# EAGLE design B105B (EAGLE 6.6.0)
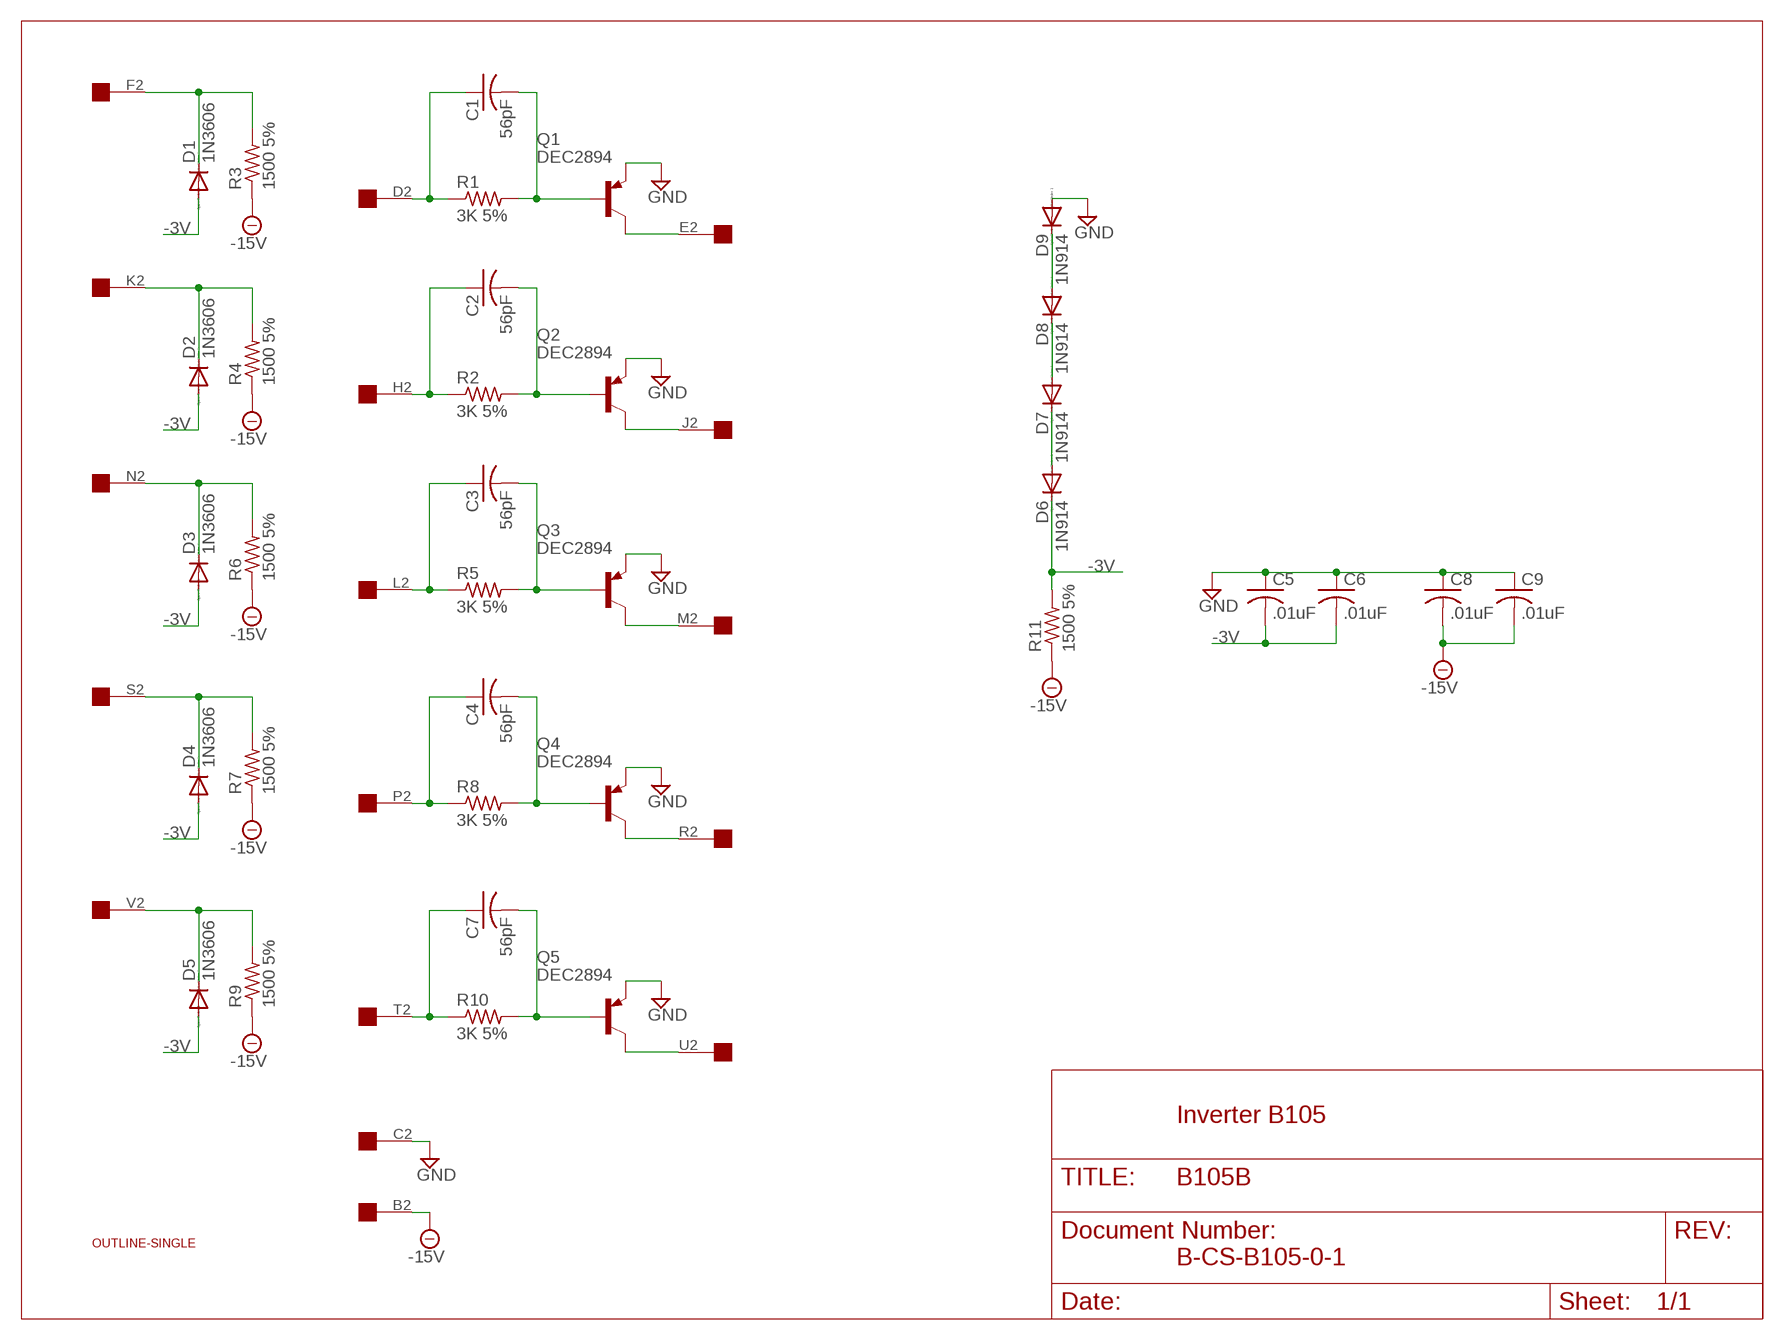
[diagram p0: schematic, sheet 1]

## Parts
C1  56pF  C-US075-032X103  [C075-032X103]
C2  56pF  C-US075-032X103  [C075-032X103]
C3  56pF  C-US075-032X103  [C075-032X103]
C4  56pF  C-US075-032X103  [C075-032X103]
C5  .01uF  C-US050-025X075  [C050-025X075]
C6  .01uF  C-US050-025X075  [C050-025X075]
C7  56pF  C-US075-032X103  [C075-032X103]
C8  .01uF  C-US050-025X075  [C050-025X075]
C9  .01uF  C-US050-025X075  [C050-025X075]
D1  1N3606  1N4148DO35-10  [DO35-10]
D2  1N3606  1N4148DO35-10  [DO35-10]
D3  1N3606  1N4148DO35-10  [DO35-10]
D4  1N3606  1N4148DO35-10  [DO35-10]
D5  1N3606  1N4148DO35-10  [DO35-10]
D6  1N914  1N4148DO35-10  [DO35-10]
D7  1N914  1N4148DO35-10  [DO35-10]
D8  1N914  1N4148DO35-10  [DO35-10]
D9  1N914  1N4148DO35-10  [DO35-10]
Q1  DEC2894  2N2904  [TO39]
Q2  DEC2894  2N2904  [TO39]
Q3  DEC2894  2N2904  [TO39]
Q4  DEC2894  2N2904  [TO39]
Q5  DEC2894  2N2904  [TO39]
R1  3K 5%  R-US_0207/10  [0207/10]
R2  3K 5%  R-US_0207/10  [0207/10]
R3  1500 5%  R-US_0207/10  [0207/10]
R4  1500 5%  R-US_0207/10  [0207/10]
R5  3K 5%  R-US_0207/10  [0207/10]
R6  1500 5%  R-US_0207/10  [0207/10]
R7  1500 5%  R-US_0207/10  [0207/10]
R8  3K 5%  R-US_0207/10  [0207/10]
R9  1500 5%  R-US_0207/10  [0207/10]
R10  3K 5%  R-US_0207/10  [0207/10]
R11  1500 5%  R-US_0207/10  [0207/10]
U$1  OUTLINE-SINGLE  [SINGLE]
U$2  EDGE-1  [EDGE-CON1]

## Nets
-3V [Supply]: C5.2 C6.2 D1.A D2.A D3.A D4.A D5.A D6.C R11.2
-15V: C8.2 C9.2 R3.1 R4.1 R6.1 R7.1 R9.1 R11.1 U$2.B2
GND [Supply]: C5.1 C6.1 C8.1 C9.1 D9.A Q1.1(E) Q2.1(E) Q3.1(E) Q4.1(E) Q5.1(E) U$2.C2
N$1: C1.1 R1.1 U$2.D2
N$3: C1.2 Q1.2(B) R1.2
N$4: Q1.3(C) U$2.E2
N$5: D1.C R3.2 U$2.F2
N$6: C2.1 R2.1 U$2.H2
N$8: C2.2 Q2.2(B) R2.2
N$9: Q2.3(C) U$2.J2
N$10: D2.C R4.2 U$2.K2
N$11: C3.1 R5.1 U$2.L2
N$13: C3.2 Q3.2(B) R5.2
N$14: Q3.3(C) U$2.M2
N$15: D3.C R6.2 U$2.N2
N$16: C4.1 R8.1 U$2.P2
N$18: C4.2 Q4.2(B) R8.2
N$19: Q4.3(C) U$2.R2
N$20: D4.C R7.2 U$2.S2
N$21: C7.1 R10.1 U$2.T2
N$23: C7.2 Q5.2(B) R10.2
N$24: Q5.3(C) U$2.U2
N$25: D5.C R9.2 U$2.V2
N$26: D8.A D9.C
N$27: D7.A D8.C
N$29: D6.A D7.C
Unconnected: U$2.A2

## Notes on the sheet
- Inverter B105
- B-CS-B105-0-1

## Library data of the parts
C1-C9 = rcl:C-US: CAPACITOR, American symbol
D1-D9 = diode:1N4148: DIODE high speed (Philips)
Q1-Q5 = transistor-pnp:2N2904*: PNP Transistror
R1-R11 = rcl:R-US_: RESISTOR, American symbol
U$1 = dec-con:OUTLINE-*: Board outlines for DEC boards.
U$2 = dec-con:EDGE-1: Single-Sided DEC Edge Connector -- (side 2)

## Net classes
1 Supply: width 0.813 mm

## Board
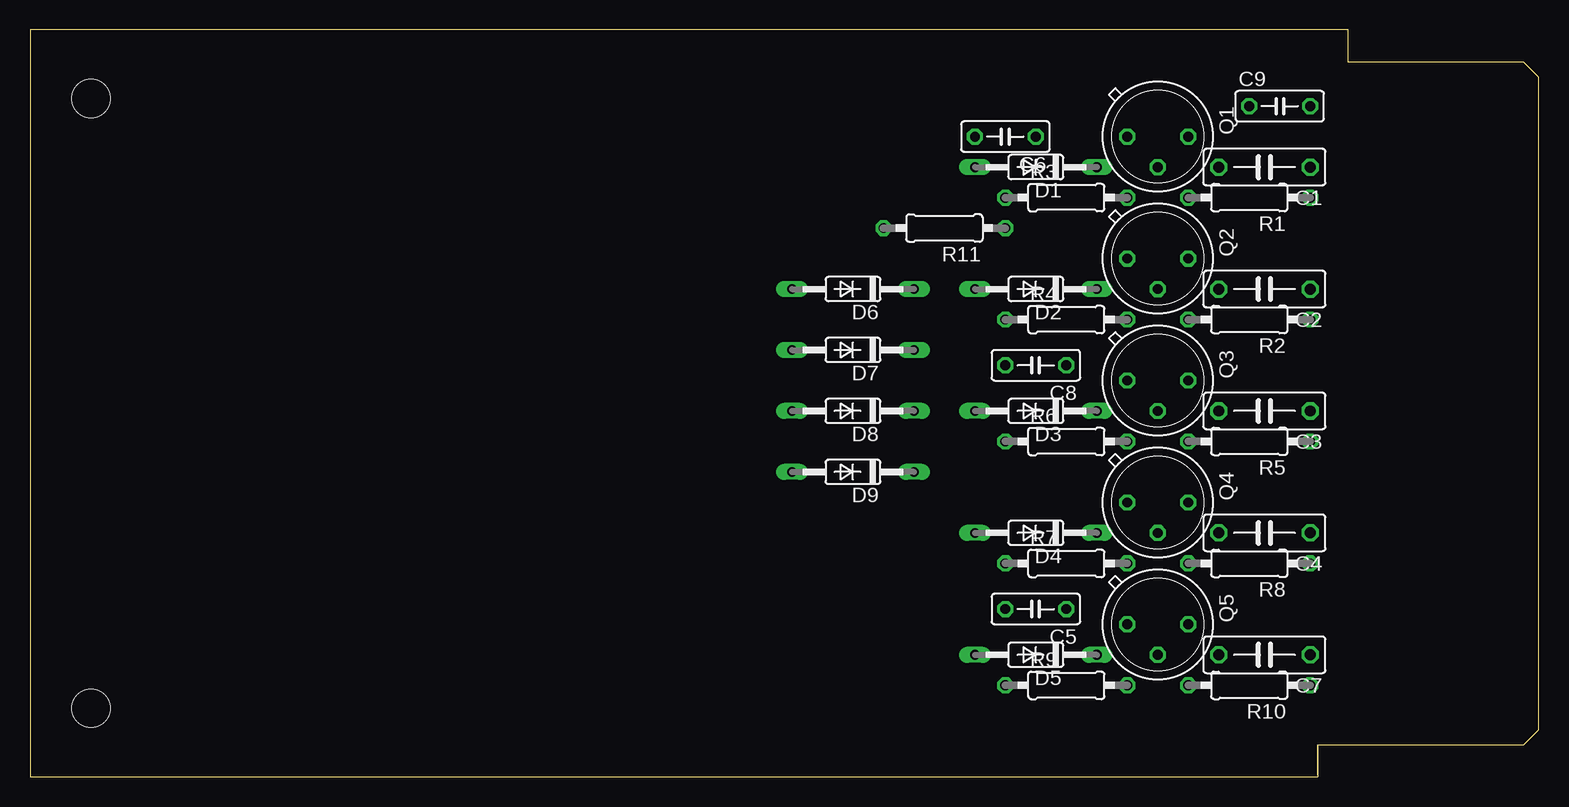
[diagram p1: board, top side]
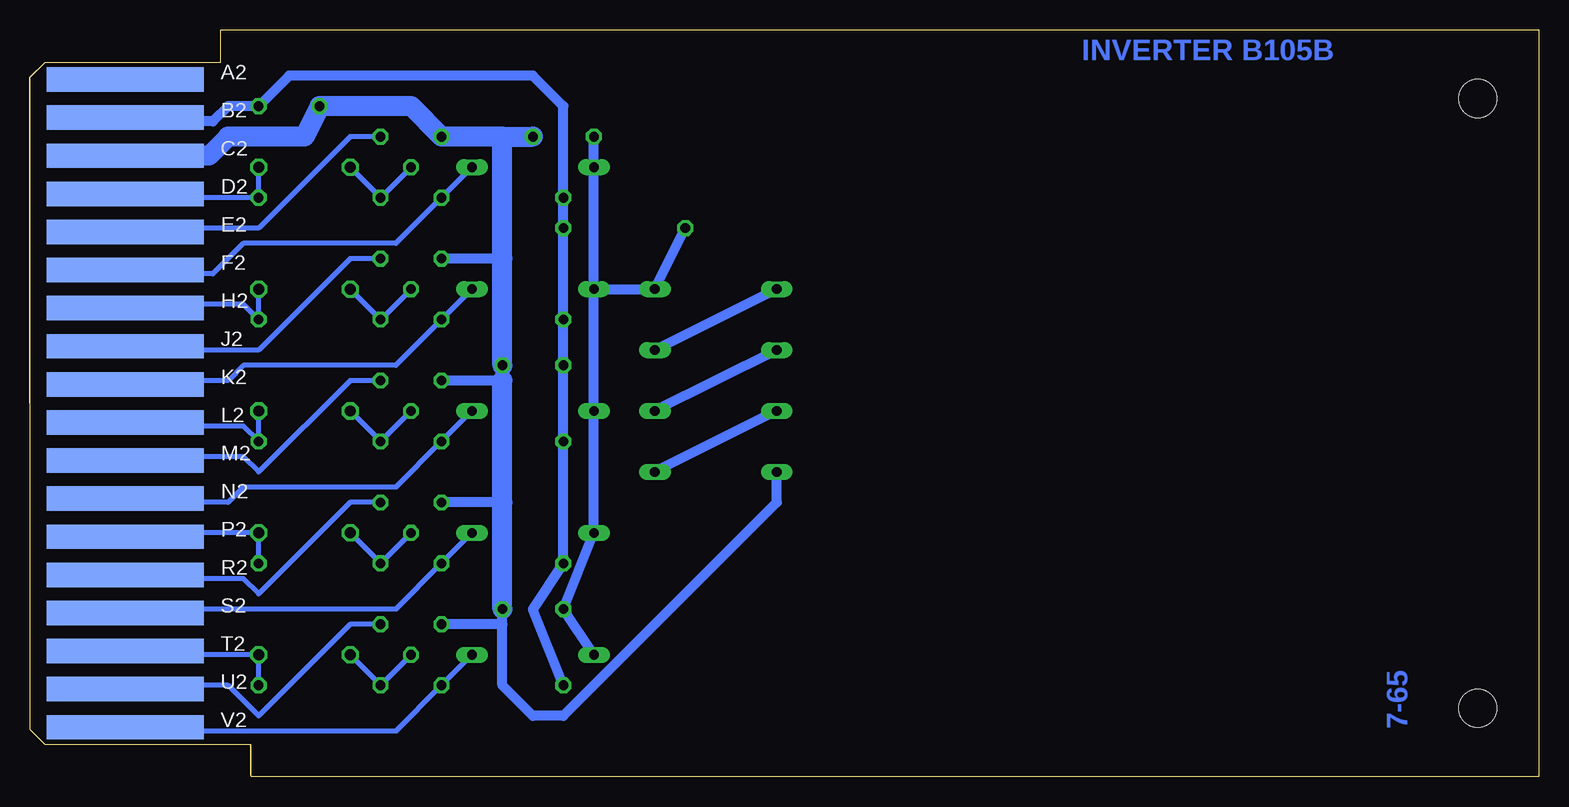
[diagram p2: board, bottom side, seen from below]

Size 125.73 x 62.23 mm. Coordinates in mm from the lower left corner, seen from the top.
Copper layers (1+16): Top 0.035mm / dielectric 1.5mm / Bottom 0.035mm
Design rules "16mils": minimum track width 16mil, minimum drill 32mil, track to track 15mil, track to pad 10mil, pad to pad 10mil, via to via 10mil, smd to smd 10mil, copper to edge 13mil, drill to drill 10mil, minimum pad ring 10mil, minimum via ring 8mil, stop-mask expansion 0mil, vias tented up to drill 0mil, thermal gap 10mil

### Footprints (pad centres in the part's own frame; a part is rotated, then mirrored left to right if it is on the bottom)
C075-032X103 = drill 0.914 octagon: 1 -3.81,0; 2 3.81,0
C050-025X075 = drill 0.813 octagon: 1 -2.54,0; 2 2.54,0
DO35-10 = drill 0.813 long: A 5.08,0; C -5.08,0
TO39 = drill 0.813 octagon: 1 0,-2.54; 2 2.54,0; 3 0,2.54
0207/10 = drill 0.813 octagon: 1 -5.08,0; 2 5.08,0
SINGLE = hole 3.175: 120.65,56.515; 120.65,5.715
EDGE-CON1 = smd 13.106 x 2.032 bottom: A2 7.938,4.128; B2 7.938,7.303; C2 7.938,10.477; D2 7.938,13.652; E2 7.938,16.828; F2 7.938,20.003; H2 7.938,23.177; J2 7.938,26.352; K2 7.938,29.527; L2 7.938,32.703; M2 7.938,35.877; N2 7.938,39.053; P2 7.938,42.227; R2 7.938,45.403; S2 7.938,48.578; T2 7.938,51.752; U2 7.938,54.928; V2 7.938,58.102

### Placement (x,y rotation side)
C1  102.87,50.8 180 top
C2  102.87,40.64 180 top
C3  102.87,30.48 180 top
C4  102.87,20.32 180 top
C5  83.82,13.97 180 top
C6  81.28,53.34 180 top
C7  102.87,10.16 180 top
C8  83.82,34.29 180 top
C9  104.14,55.88 0 top
D1  83.82,50.8 180 top
D2  83.82,40.64 180 top
D3  83.82,30.48 180 top
D4  83.82,20.32 180 top
D5  83.82,10.16 180 top
D6  68.58,40.64 180 top
D7  68.58,35.56 180 top
D8  68.58,30.48 180 top
D9  68.58,25.4 180 top
Q1  93.98,53.34 270 top
Q2  93.98,43.18 270 top
Q3  93.98,33.02 270 top
Q4  93.98,22.86 270 top
Q5  93.98,12.7 270 top
R1  101.6,48.26 180 top
R2  101.6,38.1 180 top
R3  86.36,48.26 0 top
R4  86.36,38.1 0 top
R5  101.6,27.94 180 top
R6  86.36,27.94 0 top
R7  86.36,17.78 0 top
R8  101.6,17.78 180 top
R9  86.36,7.62 0 top
R10  101.6,7.62 180 top
R11  76.2,45.72 180 top
U$1  125.73,62.23 180 top
U$2  125.73,62.23 180 top

### Tracks (layer width: path | path; a pad name or v marks a point on that pad's centre or on a via)
-3V
  Bottom 0.813: C6.2 D1.A D2.A | R11.2 D6.C D2.A | D2.A D3.A D4.A C5.2 D5.A
-15V
  Bottom 0.813: R9.1 83.82,13.97 R7.1 R6.1 C8.2 R4.1 R11.1 R3.1 81.28,55.88 83.82,58.42 104.14,58.42 C9.2 109.22,55.88 110.49,54.61 116.84,54.61 U$2.B2
GND
  Bottom 0.813: 86.36,12.7 Q5.1 | 86.36,12.7 C5.1 | 86.36,22.86 Q4.1 | Q3.1 86.36,33.02 C8.1 | D9.A 63.5,22.86 81.28,5.08 83.82,5.08 86.36,7.62 86.36,12.7 | 86.36,43.18 Q2.1
  Bottom 1.676: 86.36,53.34 C6.1 | 86.36,53.34 Q1.1 93.98,55.88 C9.1 102.87,53.34 109.22,53.34 110.81,51.75 117.16,51.75 U$2.C2 | C5.1 86.36,22.86 86.36,33.02 | C8.1 86.36,43.18 86.36,53.34
N$1
  Bottom 0.406: C1.1 R1.1 116.84,48.26 117.14,48.56 U$2.D2
N$3
  Bottom 0.406: Q1.2 R1.2 C1.2
N$4
  Bottom 0.406: Q1.3 99.06,53.34 106.68,45.72 116.84,45.72 117.17,45.39 U$2.E2
N$5
  Bottom 0.406: D1.C R3.2 95.25,44.45 107.95,44.45 110.49,41.91 116.84,41.91 117.12,42.19 U$2.F2
N$6
  Bottom 0.406: C2.1 R2.1 107.95,39.37 116.84,39.37 117.17,39.04 U$2.H2
N$8
  Bottom 0.406: C2.2 R2.2 Q2.2
N$9
  Bottom 0.406: Q2.3 99.06,43.18 106.68,35.56 116.84,35.56 117.17,35.89 U$2.J2
N$10
  Bottom 0.406: D2.C R4.2 95.25,34.29 107.95,34.29 109.22,33.02 116.84,33.02 117.14,32.72 U$2.K2
N$11
  Bottom 0.406: C3.1 R5.1 107.95,29.21 116.84,29.21 117.17,29.54 U$2.L2
N$13
  Bottom 0.406: Q3.2 R5.2 C3.2
N$14
  Bottom 0.406: Q3.3 99.06,33.02 106.68,25.4 107.95,26.67 116.84,26.67 117.17,26.34 U$2.M2
N$15
  Bottom 0.406: U$2.N2 117.17,23.19 116.84,22.86 109.22,22.86 107.95,24.13 95.25,24.13 R6.2 D3.C
N$16
  Bottom 0.406: R8.1 C4.1 116.84,20.32 117.17,19.99 U$2.P2
N$18
  Bottom 0.406: Q4.2 R8.2 C4.2
N$19
  Bottom 0.406: Q4.3 99.06,22.86 106.68,15.24 107.95,16.51 116.84,16.51 117.17,16.84 U$2.R2
N$20
  Bottom 0.406: U$2.S2 117.14,13.66 116.84,13.97 95.25,13.97 R7.2 D4.C
N$21
  Bottom 0.406: R10.1 C7.1 116.84,10.16 117.17,10.49 U$2.T2
N$23
  Bottom 0.406: Q5.2 R10.2 C7.2
N$24
  Bottom 0.406: Q5.3 99.06,12.7 106.68,5.08 109.22,7.62 116.84,7.62 117.2,7.26 U$2.U2
N$25
  Bottom 0.406: U$2.V2 117.16,4.13 116.84,3.81 95.25,3.81 R9.2 D5.C
N$26
  Bottom 0.813: D8.A D9.C
N$27
  Bottom 0.813: D7.A D8.C
N$29
  Bottom 0.813: D6.A D7.C

### Text on the board
Bottom: INVERTER B105B | 7-65